# EAGLE schematic jar-of-fireflies (EAGLE 7.6.0)
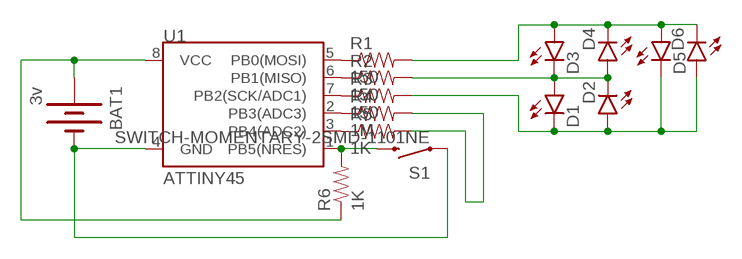
[diagram p0: schematic, sheet 1]

## Parts
BAT1  3v  BATTERY20PTH  [BATTCOM_20MM_PTH]
D1  LED3MM  [LED3MM]
D2  LED3MM  [LED3MM]
D3  LED3MM  [LED3MM]
D4  LED3MM  [LED3MM]
D5  LED3MM  [LED3MM]
D6  LED3MM  [LED3MM]
R1  150  RESISTORPTH-1/4W  [AXIAL-0.4]
R2  150  RESISTORPTH-1/4W  [AXIAL-0.4]
R3  150  RESISTORPTH-1/4W  [AXIAL-0.4]
R4  1M  RESISTORPTH-1/4W  [AXIAL-0.4]
R5  1K  RESISTORPTH-1/4W  [AXIAL-0.4]
R6  1K  RESISTORPTH-1/4W  [AXIAL-0.4]
S1  SWITCH-MOMENTARY-2SMD-1101NE  [TACTILE-SWITCH-1101NE]
U1  ATTINY45  ATTINY45TINY85-20-DIP  [DIP08]

## Nets
GND: BAT1.2(-) S1.1 U1.4(GND)
N$1: R1.P$1 U1.5(PB0(MOSI))
N$2: R2.P$1 U1.6(PB1(MISO))
N$3: R3.P$1 U1.7(PB2(SCK/ADC1))
N$4: R4.P$1 U1.2(PB3(ADC3))
N$5: R5.P$1 U1.3(PB4(ADC2))
N$6: D3.A D4.K(C) D5.A D6.K(C) R1.P$2
N$7: D1.K(C) D2.A D5.K(C) D6.A R3.P$2
N$8: D1.A D2.K(C) D3.K(C) D4.A R2.P$2
N$11: R6.P$2 S1.2 U1.1(PB5(NRES))
RING: R4.P$2 R5.P$2
VCC: BAT1.1(+) R6.P$1 U1.8(VCC)

## Library data of the parts
BAT1 = SparkFun-Electromechanical:BATTERY: Battery Holders Various common sizes : AA, AAA, 18650 (PRT-12895), 20mm coin cell and 12mm coin cell. 20MM_4LEGS, BATT-10373
D1-D6 = SparkFun-LED:LED: LEDs Standard schematic elements and footprints for 5mm, 3mm, 1206, and 0603 sized LEDs. 5mm - Spark Fun Electronics SKU : COM-00529 (and others)
R1-R6 = SparkFun-Passives:RESISTOR: Resistor Basic schematic elements and footprints for 0603, 1206, and PTH resistors.
S1 = SparkFun-Electromechanical:SWITCH-MOMENTARY-2: Various NO switches- pushbuttons, reed, etc; PROD_ID: SWCH-00815
U1 = SparkFun-DigitalIC:ATTINY45: Atmel 8-pin 2/4/8kB flash uC; PROD_ID: IC-09445; VALUE: TINY85-20-DIP